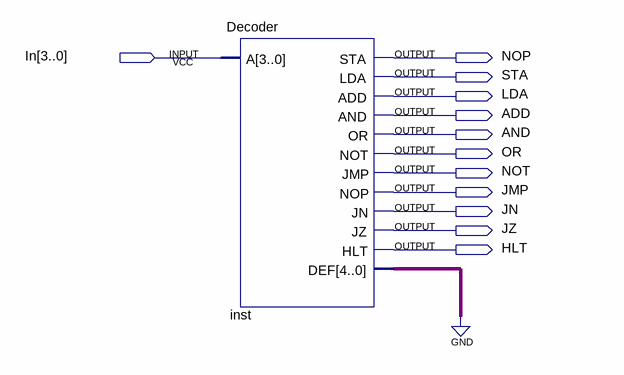
[diagram p0: schematic sheet]
// Quartus schematic DECOD.bdf as structural Verilog: 1 symbols, 12 pins
module DECOD (
  input  [3:0] In,
  output NOP,
  output STA,
  output LDA,
  output ADD,
  output AND,
  output OR,
  output NOT,
  output JMP,
  output JN,
  output JZ,
  output HLT
);

  wire [4:0] inst_def;

  Decoder inst (
    .A(In), .STA(NOP), .LDA(STA), .ADD(LDA), .AND(ADD), .OR(AND), .NOT(OR), .JMP(NOT), .NOP(JMP), .JN(JN),
    .JZ(JZ), .HLT(HLT), .DEF(inst_def));
  // also tied to GND on the sheet: {inst_def[0], inst_def[1], inst_def[2], inst_def[3], inst_def[4]}
endmodule
